# Altium schematic sheet 水表通用工装一版2.SchDoc
size A3
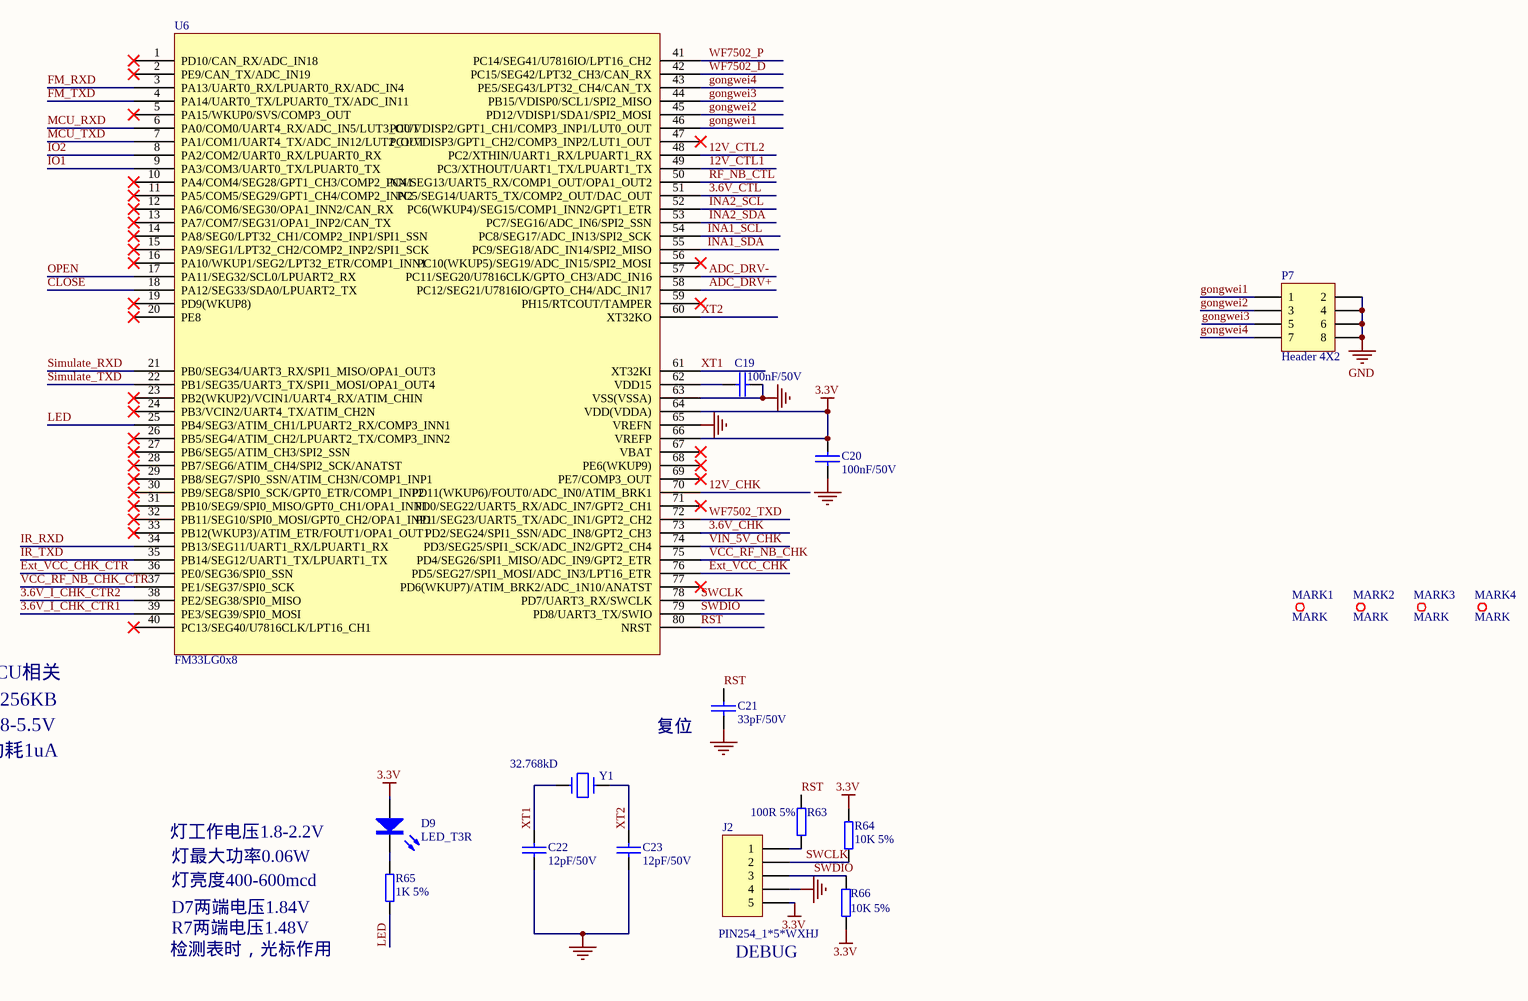
[diagram p0: 水表通用工装一版2.SchDoc]

## Parts
C19  100nF/50V  [CAP0603]
C20  100nF/50V  [CAP0603]
C21  33pF/50V  [CAP0603]
C22  12pF/50V  [CAP0603]
C23  12pF/50V  [CAP0603]
D9  LED_T3R  [LED2_300]
J2  PIN254_1*5*WXHJ  [PIN254_1*5*1100S]
MARK1  MARK  [MARK]
MARK2  MARK  [MARK]
MARK3  MARK  [MARK]
MARK4  MARK  [MARK]
P7  Header 4X2  [HDR2X4]
R63  100R 5%  [RES0603]
R64  10K 5%  [RES0603]
R65  1K 5%  [RES0603]
R66  10K 5%  [RES0603]
U6  FM33LG0x8  [LQFP80]
Y1  32.768kD  [SMD-3215_2P]

## Nets
3.3V: C20.2 D9.1 J2.5 R64.1 R66.1 U6.64(VDD(VDDA)) U6.66(VREFP)
GND: C19.2 C20.1 C21.2 C22.2 C23.1 J2.4 P7.2 P7.4 P7.6 P7.8 U6.63(VSS(VSSA)) U6.65(VREFN)
3.6V_CHK: U6.73(PD2/SEG24/SPI1_SSN/ADC_IN8/GPT2_CH3)
3.6V_CTL: U6.51(PC5/SEG14/UART5_TX/COMP2_OUT/DAC_OUT)
3.6V_I_CHK_CTR1: U6.39(PE3/SEG39/SPI0_MOSI)
3.6V_I_CHK_CTR2: U6.38(PE2/SEG38/SPI0_MISO)
12V_CHK: U6.70(PD11(WKUP6)/FOUT0/ADC_IN0/ATIM_BRK1)
12V_CTL1: U6.49(PC3/XTHOUT/UART1_TX/LPUART1_TX)
12V_CTL2: U6.48(PC2/XTHIN/UART1_RX/LPUART1_RX)
ADC_DRV+: U6.58(PC12/SEG21/U7816IO/GPTO_CH4/ADC_IN17)
ADC_DRV-: U6.57(PC11/SEG20/U7816CLK/GPTO_CH3/ADC_IN16)
CLOSE: U6.18(PA12/SEG33/SDA0/LPUART2_TX)
Ext_VCC_CHK: U6.76(PD5/SEG27/SPI1_MOSI/ADC_IN3/LPT16_ETR)
Ext_VCC_CHK_CTR: U6.36(PE0/SEG36/SPI0_SSN)
FM_RXD: U6.3(PA13/UART0_RX/LPUART0_RX/ADC_IN4)
FM_TXD: U6.4(PA14/UART0_TX/LPUART0_TX/ADC_IN11)
gongwei1: P7.1 U6.46(PC0/VDISP2/GPT1_CH1/COMP3_INP1/LUT0_OUT)
gongwei2: P7.3 U6.45(PD12/VDISP1/SDA1/SPI2_MOSI)
gongwei3: P7.5 U6.44(PB15/VDISP0/SCL1/SPI2_MISO)
gongwei4: P7.7 U6.43(PE5/SEG43/LPT32_CH4/CAN_TX)
INA1_SCL: U6.54(PC8/SEG17/ADC_IN13/SPI2_SCK)
INA1_SDA: U6.55(PC9/SEG18/ADC_IN14/SPI2_MISO)
INA2_SCL: U6.52(PC6(WKUP4)/SEG15/COMP1_INN2/GPT1_ETR)
INA2_SDA: U6.53(PC7/SEG16/ADC_IN6/SPI2_SSN)
IO1: U6.9(PA3/COM3/UART0_TX/LPUART0_TX)
IO2: U6.8(PA2/COM2/UART0_RX/LPUART0_RX)
IR_RXD: U6.34(PB13/SEG11/UART1_RX/LPUART1_RX)
IR_TXD: U6.35(PB14/SEG12/UART1_TX/LPUART1_TX)
LED: R65.1 U6.25(PB4/SEG3/ATIM_CH1/LPUART2_RX/COMP3_INN1)
MCU_RXD: U6.6(PA0/COM0/UART4_RX/ADC_IN5/LUT3_OUT)
MCU_TXD: U6.7(PA1/COM1/UART4_TX/ADC_IN12/LUT2_OUT)
OPEN: U6.17(PA11/SEG32/SCL0/LPUART2_RX)
RF_NB_CTL: U6.50(PC4/SEG13/UART5_RX/COMP1_OUT/OPA1_OUT2)
RST: C21.1 R63.1 U6.80(NRST)
Simulate_RXD: U6.21(PB0/SEG34/UART3_RX/SPI1_MISO/OPA1_OUT3)
Simulate_TXD: U6.22(PB1/SEG35/UART3_TX/SPI1_MOSI/OPA1_OUT4)
SWCLK: J2.2 R64.2 U6.78(PD7/UART3_RX/SWCLK)
SWDIO: J2.3 R66.2 U6.79(PD8/UART3_TX/SWIO)
VCC_RF_NB_CHK: U6.75(PD4/SEG26/SPI1_MISO/ADC_IN9/GPT2_ETR)
VCC_RF_NB_CHK_CTR: U6.37(PE1/SEG37/SPI0_SCK)
VIN_5V_CHK: U6.74(PD3/SEG25/SPI1_SCK/ADC_IN2/GPT2_CH4)
WF7502_D: U6.42(PC15/SEG42/LPT32_CH3/CAN_RX)
WF7502_P: U6.41(PC14/SEG41/U7816IO/LPT16_CH2)
WF7502_TXD: U6.72(PD1/SEG23/UART5_TX/ADC_IN1/GPT2_CH2)
XT1: C22.1 U6.61(XT32KI) Y1.1
XT2: C23.2 U6.60(XT32KO) Y1.2
NetC19_1: C19.1 U6.62(VDD15)
NetD9_2: D9.2 R65.2
NetJ2_1: J2.1 R63.2

Not connected (* = marked no-connect by the designer): U6 1(PD10/CAN_RX/ADC_IN18)* 2(PE9/CAN_TX/ADC_IN19)* 5(PA15/WKUP0/SVS/COMP3_OUT)* 10(PA4/COM4/SEG28/GPT1_CH3/COMP2_INN1)* 11(PA5/COM5/SEG29/GPT1_CH4/COMP2_INN2)* 12(PA6/COM6/SEG30/OPA1_INN2/CAN_RX)* 13(PA7/COM7/SEG31/OPA1_INP2/CAN_TX)* 14(PA8/SEG0/LPT32_CH1/COMP2_INP1/SPI1_SSN)* 15(PA9/SEG1/LPT32_CH2/COMP2_INP2/SPI1_SCK)* 16(PA10/WKUP1/SEG2/LPT32_ETR/COMP1_INN1)* 19(PD9(WKUP8))* 20(PE8)* 23(PB2(WKUP2)/VCIN1/UART4_RX/ATIM_CHIN)* 24(PB3/VCIN2/UART4_TX/ATIM_CH2N)* 26(PB5/SEG4/ATIM_CH2/LPUART2_TX/COMP3_INN2)* 27(PB6/SEG5/ATIM_CH3/SPI2_SSN)* 28(PB7/SEG6/ATIM_CH4/SPI2_SCK/ANATST)* 29(PB8/SEG7/SPI0_SSN/ATIM_CH3N/COMP1_INP1)* 30(PB9/SEG8/SPI0_SCK/GPT0_ETR/COMP1_INP2)* 31(PB10/SEG9/SPI0_MISO/GPT0_CH1/OPA1_INN1)* 32(PB11/SEG10/SPI0_MOSI/GPT0_CH2/OPA1_INP1)* 33(PB12(WKUP3)/ATIM_ETR/FOUT1/OPA1_OUT1)* 40(PC13/SEG40/U7816CLK/LPT16_CH1)* 47(PC1/VDISP3/GPT1_CH2/COMP3_INP2/LUT1_OUT)* 56(PC10(WKUP5)/SEG19/ADC_IN15/SPI2_MOSI)* 59(PH15/RTCOUT/TAMPER)* 67(VBAT)* 68(PE6(WKUP9))* 69(PE7/COMP3_OUT)* 71(PD0/SEG22/UART5_RX/ADC_IN7/GPT2_CH1)* 77(PD6(WKUP7)/ATIM_BRK2/ADC_1N10/ANATST)*

## Notes on the sheet
- MCU相关
- 工作电压1.8-5.5V
- 单片机内存256KB
- 静态功耗1uA
- 复位
- 灯工作电压1.8-2.2V
- 灯最大功率0.06W
- D7两端电压1.84V
- 灯亮度400-600mcd
- 检测表时，光标作用
- R7两端电压1.48V
- (near J2) DEBUG

## Library data of the parts
C19 C20 = 101020103-0021: 104pF,50 V,±10%,0603,国巨,CC0603KRX7R9BB104; Part Name: 0603贴片电容; ID: 3; SMD/DIP: SMD; Part Number: 101020103-0021
C21 = 101020103-0027: 33pF,50 V,±10%,0603,国巨,CC0603KRNPO9BN33; Part Name: 0603贴片电容; ID: 17; SMD/DIP: SMD; Part Number: 101020103-0027
C22 C23 = 101020103-0005: 12P,50 V,±5%,0603,国巨,CC0603JRNPO9BN12; Part Name: 0603贴片电容; ID: 11; SMD/DIP: SMD; Part Number: 101020103-0005
D9 = 101040102-0001: 圆形插件,3mm 圆形,插件,红光,湖北匡通电子有限公司,3BB4HC; Part Name: 发光二极管; ID: 6; SMD/DIP: DIP; Part Number: 101040102-0001
J2 = AD_WXHJ_PinHeader_02: 1*5 ，Φ1.0 ，2.54mm，直脚,无需焊接器件; Part Name: 排针; ID: 17; SMD/DIP: DIP; Part Number: AD_WXHJ_PinHeader_02
MARK1-MARK4 = AD_WXHJ_MARK_01: MARK点; ID: 8; SMD/DIP: SMD; Part Number: AD_WXHJ_MARK_01; Part Name: MARK点
P7 = Header 4X2: Header, 4-Pin, Dual row
R63 = 101010103-0022: 100R,±5%,1/10W,0603,国巨,RC0603JR-07100RL; Part Name: 0603贴片电阻; ID: 5; SMD/DIP: SMD; Part Number: 101010103-0022
R64 R66 = 101010103-0003: 国巨,±5%,0603,,155 ℃,-55 ℃,RC0603JR-0710KL,无铅,200 ppm/℃,1/10W,,10K; Part Name: 0603贴片电阻; ID: 7; SMD/DIP: SMD; Part Number: 101010103-0003
R65 = 101010103-0008: 1K,±5%,1/10W,0603,国巨,RC0603JR-071KL; Part Name: 0603贴片电阻; ID: 9; SMD/DIP: SMD; Part Number: 101010103-0008
Y1 = 1010601-0009: Part Number: 1010601-0020; Part Name: 贴片晶振; ID: 20; SMD/DIP: SMD